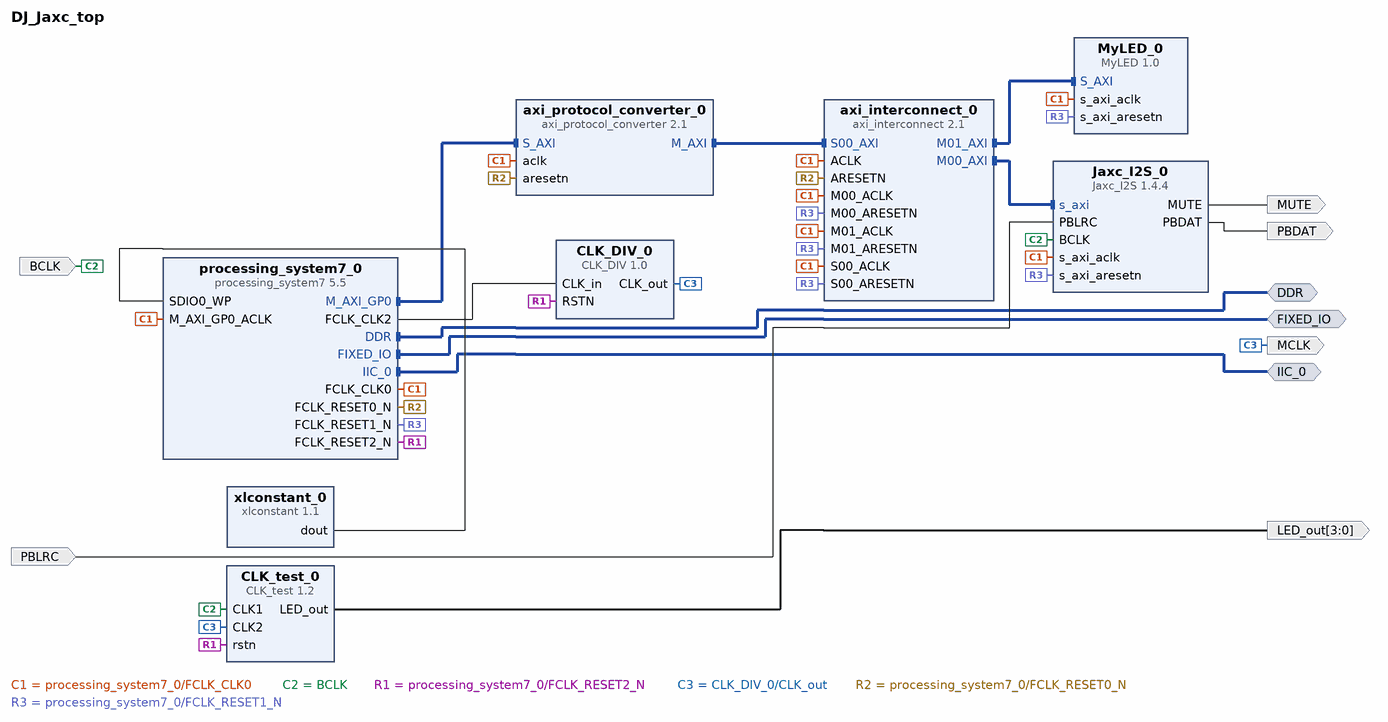
[diagram p0: block diagram of the top level]
# Vivado block design DJ_Jaxc_top, Vivado 2015.2.1
create_bd_design DJ_Jaxc_top

create_bd_intf_port -mode Master -vlnv xilinx.com:interface:ddrx_rtl:1.0 DDR
create_bd_intf_port -mode Master -vlnv xilinx.com:display_processing_system7:fixedio_rtl:1.0 FIXED_IO
create_bd_intf_port -mode Master -vlnv xilinx.com:interface:iic_rtl:1.0 IIC_0
create_bd_port -dir I BCLK
create_bd_port -dir I PBLRC
create_bd_port -dir O PBDAT
create_bd_port -dir O MUTE
create_bd_port -dir O MCLK
create_bd_port -dir O -from 3 -to 0 LED_out

create_bd_cell -type ip -vlnv xilinx.com:ip:processing_system7:5.5 processing_system7_0
set_property -dict [list \
  CONFIG.PCW_FPGA1_PERIPHERAL_FREQMHZ 150.000000 \
  CONFIG.PCW_S_AXI_HP0_DATA_WIDTH 32 \
  CONFIG.PCW_EN_CLK1_PORT 1 \
  CONFIG.PCW_EN_CLK2_PORT 1 \
  CONFIG.PCW_EN_RST1_PORT 1 \
  CONFIG.PCW_EN_RST2_PORT 1 \
  CONFIG.PCW_IMPORT_BOARD_PRESET /home/jaxc/FPGA/DJ-Jaxc/ZYBO_zynq_def.xml \
  CONFIG.PCW_QSPI_GRP_SINGLE_SS_ENABLE 1 \
  CONFIG.PCW_ENET0_PERIPHERAL_ENABLE 1 \
  CONFIG.PCW_ENET0_ENET0_IO {MIO 16 .. 27} \
  CONFIG.PCW_ENET0_GRP_MDIO_ENABLE 1 \
] [get_bd_cells processing_system7_0]
# 1 more settings of processing_system7_0 are not shown: defaults, MIO pin electricals, DDR timing, and values the tool derives
create_bd_cell -type ip -vlnv xilinx.com:ip:xlconstant:1.1 xlconstant_0
create_bd_cell -type ip -vlnv xilinx.com:ip:axi_protocol_converter:2.1 axi_protocol_converter_0
set_property -dict [list \
  CONFIG.MI_PROTOCOL AXI4LITE \
  CONFIG.TRANSLATION_MODE 2 \
  CONFIG.ID_WIDTH 12 \
] [get_bd_cells axi_protocol_converter_0]
create_bd_cell -type ip -vlnv xilinx.com:ip:axi_interconnect:2.1 axi_interconnect_0
set_property -dict {CONFIG.STRATEGY 1 CONFIG.M00_HAS_REGSLICE 4 CONFIG.M01_HAS_REGSLICE 4} [get_bd_cells axi_interconnect_0]
create_bd_cell -type ip -vlnv Jaxcie.com:Audio:Jaxc_I2S:1.4.4 Jaxc_I2S_0
create_bd_cell -type ip -vlnv Jaxcie.org:user:CLK_DIV:1.0 CLK_DIV_0
create_bd_cell -type ip -vlnv Jaxcie.org:user:CLK_test:1.2 CLK_test_0
create_bd_cell -type ip -vlnv user.org:user:MyLED:1.0 MyLED_0

# ---- connections ----

connect_bd_intf_net [get_bd_intf_pins processing_system7_0/M_AXI_GP0] [get_bd_intf_pins axi_protocol_converter_0/S_AXI]
connect_bd_intf_net [get_bd_intf_pins axi_protocol_converter_0/M_AXI] [get_bd_intf_pins axi_interconnect_0/S00_AXI]
connect_bd_intf_net [get_bd_intf_pins Jaxc_I2S_0/s_axi] [get_bd_intf_pins axi_interconnect_0/M00_AXI]
connect_bd_intf_net [get_bd_intf_pins MyLED_0/S_AXI] [get_bd_intf_pins axi_interconnect_0/M01_AXI]
connect_bd_intf_net [get_bd_intf_ports DDR] [get_bd_intf_pins processing_system7_0/DDR]
connect_bd_intf_net [get_bd_intf_ports FIXED_IO] [get_bd_intf_pins processing_system7_0/FIXED_IO]
connect_bd_intf_net [get_bd_intf_ports IIC_0] [get_bd_intf_pins processing_system7_0/IIC_0]
connect_bd_net [get_bd_pins xlconstant_0/dout] [get_bd_pins processing_system7_0/SDIO0_WP]
connect_bd_net [get_bd_pins processing_system7_0/FCLK_CLK0] \
  [get_bd_pins axi_protocol_converter_0/aclk] [get_bd_pins processing_system7_0/M_AXI_GP0_ACLK] \
  [get_bd_pins Jaxc_I2S_0/s_axi_aclk] [get_bd_pins MyLED_0/s_axi_aclk] [get_bd_pins axi_interconnect_0/ACLK] \
  [get_bd_pins axi_interconnect_0/S00_ACLK] [get_bd_pins axi_interconnect_0/M00_ACLK] \
  [get_bd_pins axi_interconnect_0/M01_ACLK]
connect_bd_net [get_bd_ports BCLK] [get_bd_pins Jaxc_I2S_0/BCLK] [get_bd_pins CLK_test_0/CLK1]
connect_bd_net [get_bd_ports PBLRC] [get_bd_pins Jaxc_I2S_0/PBLRC]
connect_bd_net [get_bd_pins Jaxc_I2S_0/PBDAT] [get_bd_ports PBDAT]
connect_bd_net [get_bd_pins Jaxc_I2S_0/MUTE] [get_bd_ports MUTE]
connect_bd_net [get_bd_pins processing_system7_0/FCLK_CLK2] [get_bd_pins CLK_DIV_0/CLK_in]
connect_bd_net [get_bd_pins processing_system7_0/FCLK_RESET2_N] [get_bd_pins CLK_DIV_0/RSTN] [get_bd_pins CLK_test_0/rstn]
connect_bd_net [get_bd_pins CLK_DIV_0/CLK_out] [get_bd_ports MCLK] [get_bd_pins CLK_test_0/CLK2]
connect_bd_net [get_bd_pins CLK_test_0/LED_out] [get_bd_ports LED_out]
connect_bd_net [get_bd_pins processing_system7_0/FCLK_RESET0_N] \
  [get_bd_pins axi_protocol_converter_0/aresetn] [get_bd_pins axi_interconnect_0/ARESETN]
connect_bd_net -net S00_ARESETN_1 [get_bd_pins processing_system7_0/FCLK_RESET1_N] \
  [get_bd_pins MyLED_0/s_axi_aresetn] [get_bd_pins Jaxc_I2S_0/s_axi_aresetn] [get_bd_pins axi_interconnect_0/S00_ARESETN] \
  [get_bd_pins axi_interconnect_0/M00_ARESETN] [get_bd_pins axi_interconnect_0/M01_ARESETN]

# ---- address map ----
assign_bd_address -offset 0x43C00000 -range 64K -target_address_space [get_bd_addr_spaces processing_system7_0/Data] [get_bd_addr_segs Jaxc_I2S_0/s_axi/reg0]
assign_bd_address -offset 0x43C10000 -range 64K -target_address_space [get_bd_addr_spaces processing_system7_0/Data] [get_bd_addr_segs MyLED_0/S_AXI/S_AXI_reg]

validate_bd_design
save_bd_design
